# EAGLE design g3d2_ctrl_2 (EAGLE 6.2)
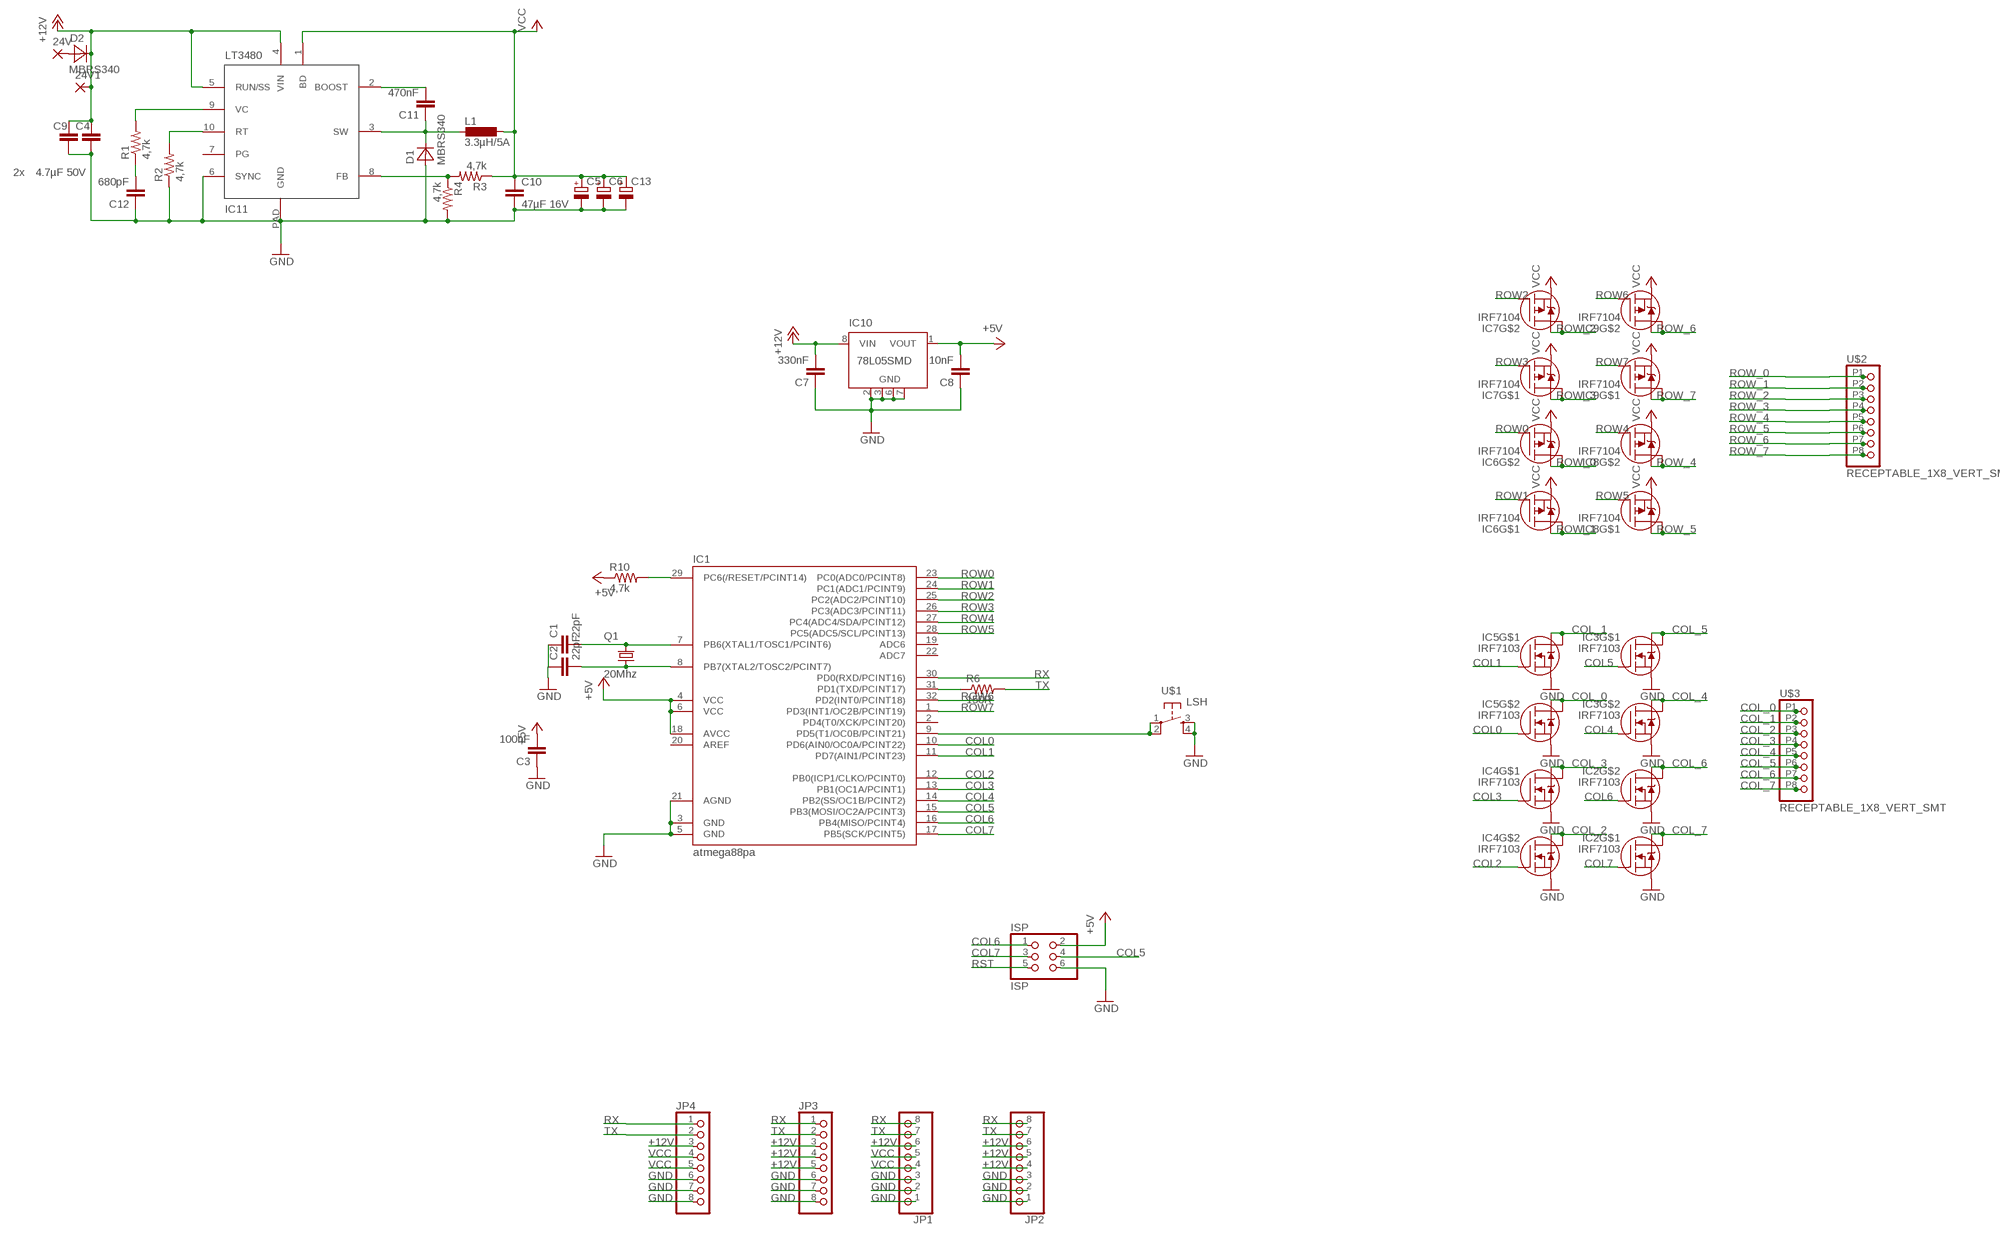
[diagram p0: schematic, sheet 1]

## Parts
24V  SMD5  [SMD2,54-5,08]
24V1  SMD5  [SMD2,54-5,08]
C1  22pF  CAP0805  [0805]
C2  22pF  CAP0805  [0805]
C3  100nF  CAP0805  [0805]
C4  4.7µF 50V  CAP1210  [1210]
C5  CPOL-EUSMCD  [SMC_D]
C6  CPOL-EUSMCD  [SMC_D]
C7  330nF  CAP0805  [0805]
C8  10nF  CAP0805  [0805]
C9  4.7µF 50V  CAP1210  [1210]
C10  47µF 16V  CAP1210  [1210]
C11  470nF  CAP0805  [0805]
C12  680pF  CAP0805  [0805]
C13  CPOL-EUSMCD  [SMC_D]
D1  MBRS340  [DO214AB]
D2  MBRS340  [DO214AB]
IC1  atmega88pa  MEGA48/88/168-AU  [TQFP32-08]
IC2  IRF7103  [SO8-2]
IC3  IRF7103  [SO8-2]
IC4  IRF7103  [SO8-2]
IC5  IRF7103  [SO8-2]
IC6  IRF7104  [SO8-2]
IC7  IRF7104  [SO8-2]
IC8  IRF7104  [SO8-2]
IC9  IRF7104  [SO8-2]
IC10  78L05SMD  [SO08]
IC11  LT3972  LT3480  [MSOP10-PAD]
ISP  ISP  PINHD-2X03_2.54  [2X03]
JP1  PINHD-1X08_2.54-SMD-90°  [1X08SMD/90]
JP2  PINHD-1X08_2.54-SMD-90°  [1X08SMD/90]
JP3  PINHD-1X08_2.54-SMD-90°  [1X08SMD/90]
JP4  PINHD-1X08_2.54-SMD-90°  [1X08SMD/90]
L1  3.3µH/5A  DO3316P  [DO3316P]
Q1  20Mhz  X22-OSCILLATOR  [X22]
R1  4,7k  RESISTOR  [0805]
R2  4,7k  RESISTOR  [0805]
R3  4,7k  RESISTOR  [0805]
R4  4,7k  RESISTOR  [0805]
R6  150R  RESISTOR  [0805]
R10  4,7k  RESISTOR  [0805]
U$1  LSH  [LSH]
U$2  RECEPTABLE_1X8_VERT_SMT  [RECEPTABLE_1X8_VERT_SMT]
U$3  RECEPTABLE_1X8_VERT_SMT  [RECEPTABLE_1X8_VERT_SMT]

## Nets
+5V: C3.2 C8.2 IC1.4(VCC) IC1.6(VCC) IC1.18(AVCC) IC10.1(VOUT) ISP.2 R10.1
+12V: 24V1.1(P) C4.1 C7.2 C9.1 D2.K(C) IC10.8(VIN) IC11.4(VIN) IC11.5(RUN/SS) JP1.6 JP2.4 JP2.5 JP2.6 JP3.3 JP3.4 JP3.5 JP4.3
COL0: IC1.10(PD6(AIN0/OC0A/PCINT22)) IC5.4(G)
COL1: IC1.11(PD7(AIN1/PCINT23)) IC5.2(G)
COL2: IC1.12(PB0(ICP1/CLKO/PCINT0)) IC4.4(G)
COL3: IC1.13(PB1(OC1A/PCINT1)) IC4.2(G)
COL4: IC1.14(PB2(SS/OC1B/PCINT2)) IC3.4(G)
COL5: IC1.15(PB3(MOSI/OC2A/PCINT3)) IC3.2(G) ISP.4
COL6: IC1.16(PB4(MISO/PCINT4)) IC2.4(G) ISP.1
COL7: IC1.17(PB5(SCK/PCINT5)) IC2.2(G) ISP.3
COL_0: IC5.5(D) IC5.6(D) U$3.P1
COL_1: IC5.7(D) IC5.8(D) U$3.P2
COL_2: IC4.5(D) IC4.6(D) U$3.P3
COL_3: IC4.7(D) IC4.8(D) U$3.P4
COL_4: IC3.5(D) IC3.6(D) U$3.P5
COL_5: IC3.7(D) IC3.8(D) U$3.P6
COL_6: IC2.5(D) IC2.6(D) U$3.P7
COL_7: IC2.7(D) IC2.8(D) U$3.P8
GND: C1.1 C2.1 C3.1 C4.2 C5.- C6.- C7.1 C8.1 C9.2 C10.2 C12.1 C13.- D1.A IC1.3(GND) IC1.5(GND) IC1.21(AGND) IC2.1(S) IC2.3(S) IC3.1(S) IC3.3(S) IC4.1(S) IC4.3(S) IC5.1(S) IC5.3(S) IC10.2(GND) IC10.3(GND) IC10.6(GND) IC10.7(GND) IC11.6(SYNC) IC11.PAD(GND) ISP.6 JP1.1 JP1.2 JP1.3 JP2.1 JP2.2 JP2.3 JP3.6 JP3.7 JP3.8 JP4.6 JP4.7 JP4.8 R2.1 R4.2 U$1.3 U$1.4
N$1: C2.2 IC1.8(PB7(XTAL2/TOSC2/PCINT7)) Q1.1
N$3: C1.2 IC1.7(PB6(XTAL1/TOSC1/PCINT6)) Q1.3
N$4: IC1.31(PD1(TXD/PCINT17)) R6.1
N$5: 24V.1(P) D2.A
N$6: IC11.10(RT) R2.2
N$7: IC1.9(PD5(T1/OC0B/PCINT21)) U$1.1 U$1.2
N$10: C12.2 R1.1
N$14: IC11.9(VC) R1.2
N$15: C11.1 D1.K(C) IC11.3(SW) L1.1
N$16: IC11.8(FB) R3.2 R4.1
N$17: C11.2 IC11.2(BOOST)
ROW0: IC1.23(PC0(ADC0/PCINT8)) IC6.4(G)
ROW1: IC1.24(PC1(ADC1/PCINT9)) IC6.2(G)
ROW2: IC1.25(PC2(ADC2/PCINT10)) IC7.4(G)
ROW3: IC1.26(PC3(ADC3/PCINT11)) IC7.2(G)
ROW4: IC1.27(PC4(ADC4/SDA/PCINT12)) IC8.4(G)
ROW5: IC1.28(PC5(ADC5/SCL/PCINT13)) IC8.2(G)
ROW6: IC1.32(PD2(INT0/PCINT18)) IC9.4(G)
ROW7: IC1.1(PD3(INT1/OC2B/PCINT19)) IC9.2(G)
ROW_0: IC6.5(D) IC6.6(D) U$2.P1
ROW_1: IC6.7(D) IC6.8(D) U$2.P2
ROW_2: IC7.5(D) IC7.6(D) U$2.P3
ROW_3: IC7.7(D) IC7.8(D) U$2.P4
ROW_4: IC8.5(D) IC8.6(D) U$2.P5
ROW_5: IC8.7(D) IC8.8(D) U$2.P6
ROW_6: IC9.5(D) IC9.6(D) U$2.P7
ROW_7: IC9.7(D) IC9.8(D) U$2.P8
RST: IC1.29(PC6(/RESET/PCINT14)) ISP.5 R10.2
RX: IC1.30(PD0(RXD/PCINT16)) JP1.8 JP2.8 JP3.1 JP4.1
TX: JP1.7 JP2.7 JP3.2 JP4.2 R6.2
VCC: C5.+ C6.+ C10.1 C13.+ IC6.1(S) IC6.3(S) IC7.1(S) IC7.3(S) IC8.1(S) IC8.3(S) IC9.1(S) IC9.3(S) IC11.1(BD) JP1.4 JP1.5 JP4.4 JP4.5 L1.2 R3.1
Unconnected: IC1.2(PD4(T0/XCK/PCINT20)) IC1.19(ADC6) IC1.20(AREF) IC1.22(ADC7) IC10.4(NC) IC10.5(NC) IC11.7(PG)

## Notes on the sheet
- 2x

## Library data of the parts
24V 24V1 = wirepad:SMD5: SMD PAD
C1-C4 C7-C12 = SparkFun:CAP: Capacitor Standard 0603 ceramic capacitor, and 0.1" leaded capacitor.
C5 C6 C13 = rcl:CPOL-EU: POLARIZED CAPACITOR, European symbol
D1 D2 = seb:MBRS340
IC1 = avr-4:MEGA48/88/168
IC2-IC5 = irf-2:IRF7103: HEXFET® Power MOSFET Adavanced Process Technology Ultra Low On-Resistance Dual N-Channel MOSFET Surface Mount Available in Tape & Reel Dynamic dv/dt Rating Fast Switching Please connect both Drain-Pins of each FET for thermal Reasons! (Pin 5 with Pin 6, 7 with 8)
IC6-IC9 = irf-2:IRF7104: HEXFET® Power MOSFET Adavanced Process Technology Ultra Low On-Resistance Dual P-Channel MOSFET Surface Mount Available in Tape & Reel Dynamic dv/dt Rating Fast Switching Please connect both Drain-Pins of each FET for thermal Reasons! (Pin 5 with Pin 6, 7 with 8)
IC10 = linear:78L*SMD: Positive VOLTAGE REGULATOR
IC11 = seb:LT3480
ISP = pinhead-2:PINHD-2X03: PIN HEADER
JP1-JP4 = pinhead-2:PINHD-1X08: PIN HEADER
L1 = inductor-coilcraft:DO3316P: COILCRAFT; OC_FARNELL: unknown; OC_NEWARK: unknown
Q1 = seb:X22-OSCILLATOR
R1-R4 R6 R10 = SparkFun:RESISTOR: Resistor Basic schematic elements and footprints for 0603, 1206, and PTH 1/10th watt (small) resistors.
U$1 = switch-tact:LSH
U$2 U$3 = seb:RECEPTABLE_1X8_VERT_SMT

## Board
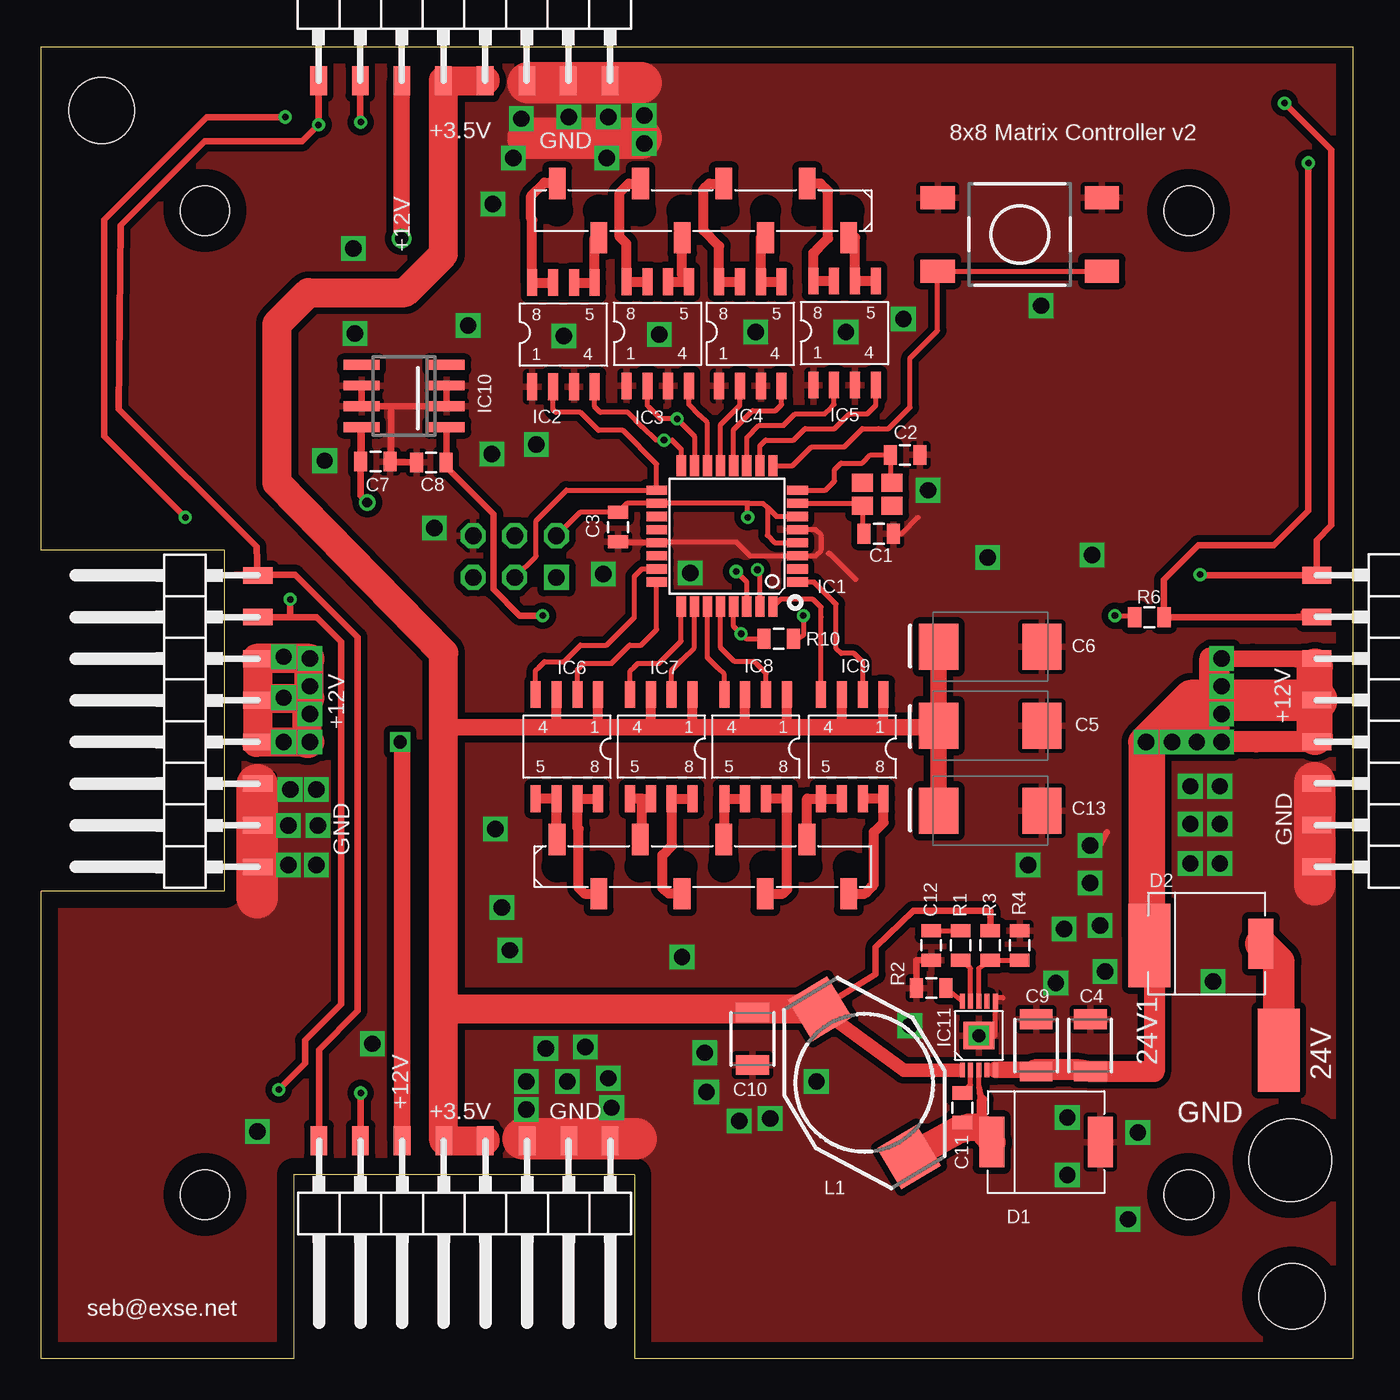
[diagram p1: board, top side]
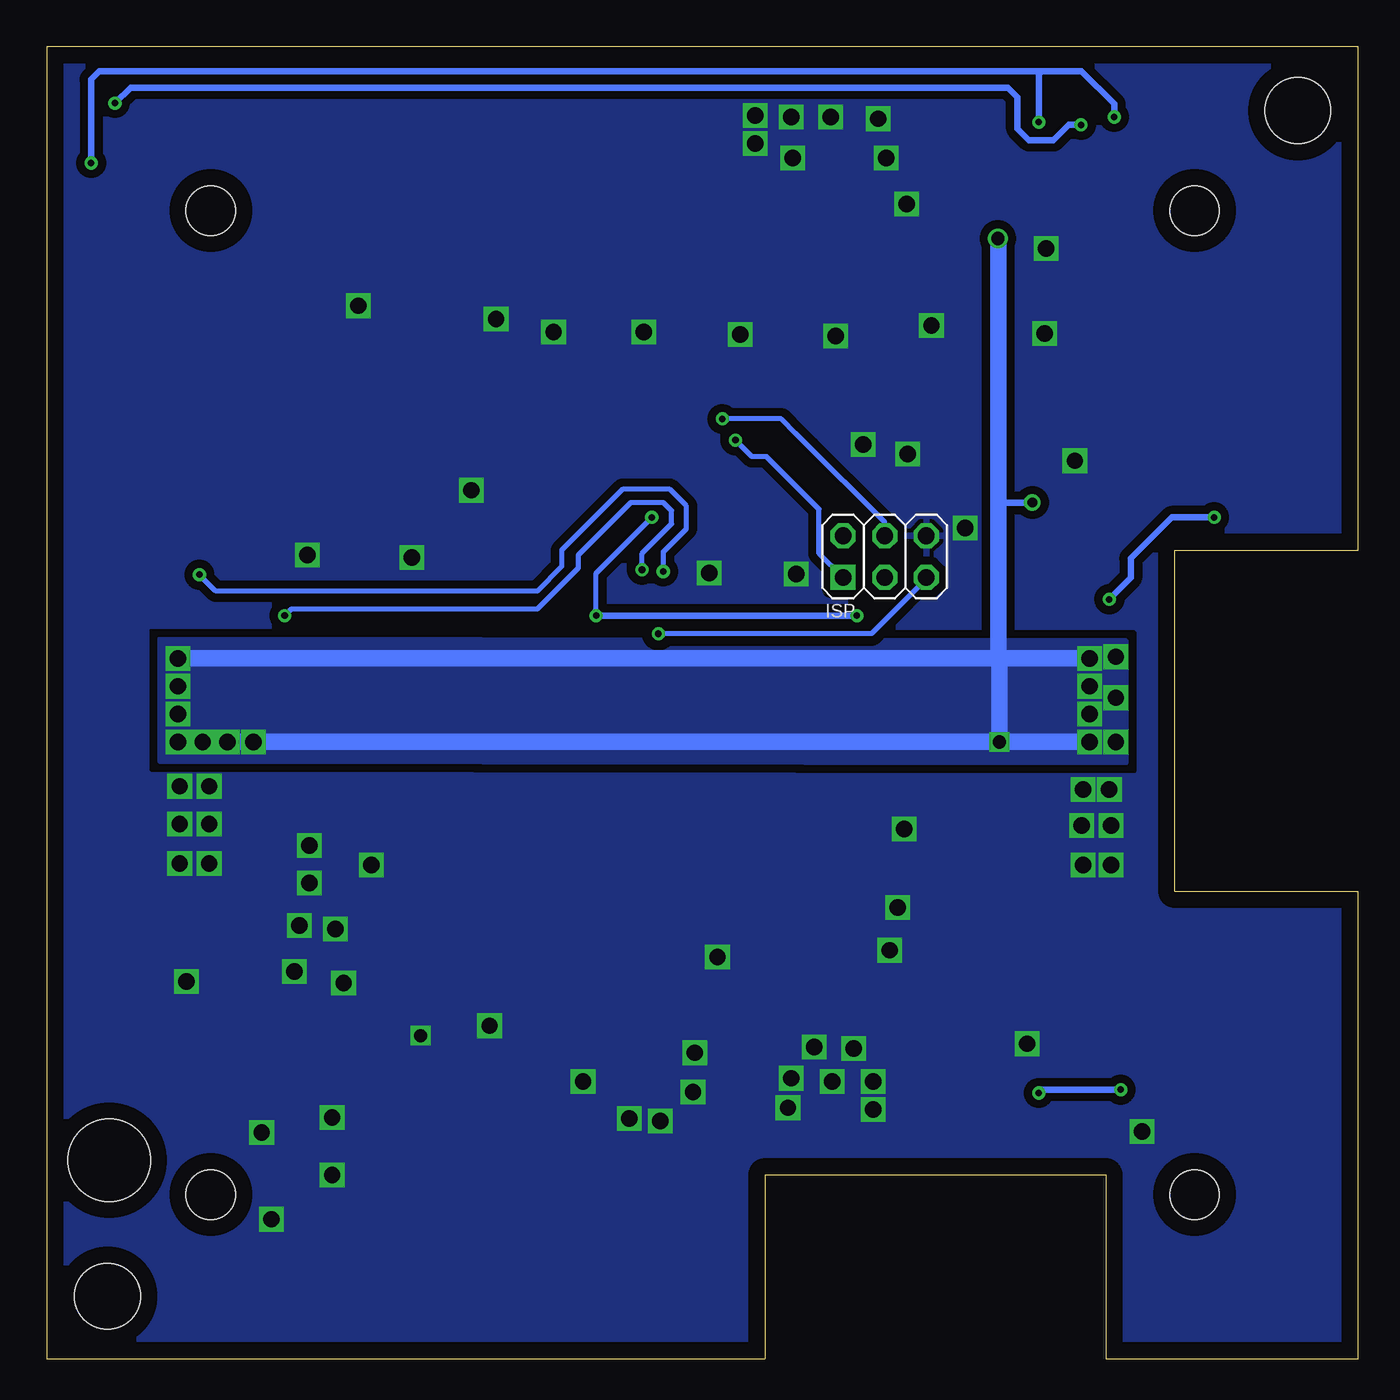
[diagram p2: board, bottom side, seen from below]

Size 80 x 80 mm. Coordinates in mm from the lower left corner, seen from the top.
Outline: 80,0 36.2,0 36.2,11.2 15.4,11.2 15.4,0 0,0 0,28.5 11.2,28.5 11.2,49.2 11.2,49.3 0,49.3 0,80 80,80 80,0
Copper layers (1*16): Top 0.035mm / dielectric 1.5mm / Bottom 0.035mm
Design rules: minimum track width 10mil, minimum drill 24mil, track to track 8mil, track to pad 8mil, pad to pad 8mil, via to via 8mil, smd to smd 8mil, copper to edge 40mil, drill to drill 8mil, minimum pad ring 10mil, minimum via ring 8mil, stop-mask expansion 4mil, vias tented up to drill 40mil, thermal gap 10mil
Holes 3 mm at 70,70 10,70 10,10 70,10
Holes 4 mm at 3.7,76.1 76.3,3.8
Holes 5 mm at 76.2,12.1

### Footprints (pad centres in the part's own frame; a part is rotated, then mirrored left to right if it is on the bottom)
SMD2,54-5,08 = smd 2.54 x 5.08: 1 0,0
0805 = smd 0.8 x 1.2: 1 -0.9,0; 2 0.9,0
1210 = smd 1.2 x 2: 1 -1.6,0; 2 1.6,0
SMC_D = smd 2.4 x 2.8: + -3.15,0; - 3.15,0
DO214AB = smd 1.52 x 3.07: A 3.305,0; K -3.305,0
TQFP32-08 = smd 1.27 x 0.559: 1 -4.293,2.8; 2 -4.293,2; 3 -4.293,1.2; 4 -4.293,0.4; 5 -4.293,-0.4; 6 -4.293,-1.2; 7 -4.293,-2; 8 -4.293,-2.8; 17 4.293,-2.8; 18 4.293,-2; 19 4.293,-1.2; 20 4.293,-0.4; 21 4.293,0.4; 22 4.293,1.2; 23 4.293,2; 24 4.293,2.8 | smd 0.559 x 1.27: 9 -2.8,-4.293; 10 -2,-4.293; 11 -1.2,-4.293; 12 -0.4,-4.293; 13 0.4,-4.293; 14 1.2,-4.293; 15 2,-4.293; 16 2.8,-4.293; 25 2.8,4.293; 26 2,4.293; 27 1.2,4.293; 28 0.4,4.293; 29 -0.4,4.293; 30 -1.2,4.293; 31 -2,4.293; 32 -2.8,4.293
SO8-2 = smd 0.61 x 1.626: 1 -2.54,-2.54; 2 -1.27,-2.54; 3 0,-2.54; 4 1.27,-2.54; 5 1.27,3.81; 6 0,3.81; 7 -1.27,3.81; 8 -2.54,3.81
SO08 = smd 0.6 x 2.2: 1 -1.905,-2.6; 2 -0.635,-2.6; 3 0.635,-2.6; 4 1.905,-2.6; 5 1.905,2.6; 6 0.635,2.6; 7 -0.635,2.6; 8 -1.905,2.6
MSOP10-PAD = smd 0.305 x 0.889: 1 -1,-2.095; 2 -0.5,-2.095; 3 0,-2.095; 4 0.5,-2.095; 5 1,-2.095; 6 1,2.095; 7 0.5,2.095; 8 0,2.095; 9 -0.5,2.095; 10 -1,2.095 | smd 1.88 x 1.68: PAD 0,0
2X03 = drill 1.016 square: 1 -2.54,-1.27 | drill 1.016 octagon: 2 -2.54,1.27; 3 0,-1.27; 4 0,1.27; 5 2.54,-1.27; 6 2.54,1.27
1X08SMD/90 = smd 1.016 x 1.778: 1 -1.27,-5.08; 2 1.27,-5.08; 3 3.81,-5.08; 4 6.35,-5.08; 5 8.89,-5.08; 6 11.43,-5.08; 7 13.97,-5.08; 8 16.51,-5.08
DO3316P = smd 2.92 x 2.79: 1 -5.28,0; 2 5.28,0
X22 = smd 1.3 x 1.1: 1 0.9,0.7; 2 -0.9,0.7; 3 -0.9,-0.7; 4 0.9,-0.7
LSH = smd 2.1 x 1.4: 1 -5.005,2.24; 2 5.015,2.24; 3 -5.005,-2.24; 4 5.005,-2.24
RECEPTABLE_1X8_VERT_SMT = smd 1.02 x 1.9: P1 -7.62,1.65; P2 -5.08,-1.65; P3 -2.54,1.65; P4 0,-1.65; P5 2.54,1.65; P6 5.08,-1.65; P7 7.62,1.65; P8 10.16,-1.65

### Placement (x,y rotation side)
24V  75.5,18.8 0 top
24V1  67.6,25.2 0 top
C1  51.1,50.3 180 top
C2  52.7,55.1 180 top
C3  35.2,50.7 90 top
C4  64,19.1 90 top
C5  57.9,38.6 0 top
C6  57.9,43.4 0 top
C7  20.4,54.7 180 top
C8  23.8,54.65 0 top
C9  60.7,19.1 90 top
C10  43.4,19.5 270 top
C11  56.2,15.3 90 top
C12  54.3,25.2 90 top
C13  57.9,33.4 0 top
D1  61.3,13.2 0 top
D2  71.1,25.3 0 top
IC1  41.85,50.15 180 top
IC2  32.5,61.8 0 top
IC3  38.25,61.85 0 top
IC4  43.9,61.85 0 top
IC5  49.65,61.9 0 top
IC6  31.45,37.95 180 top
IC7  37.2,37.95 180 top
IC8  42.95,37.95 180 top
IC9  48.85,37.95 180 top
IC10  22.15,58.7 90 top
IC11  57.2,19.7 0 top
ISP  28.9,48.9 0 bottom
JP1  33.46,8.21 180 top
JP2  8.15,31.25 90 top
JP3  82.9,46.5 270 top
JP4  18.2,83 0 top
L1  50.22,16.81 121 top
Q1  51,52.7 0 top
R1  56.1,25.2 270 top
R2  54.3,22.6 0 top
R3  57.9,25.2 270 top
R4  59.7,25.2 90 top
R6  67.6,45.2 0 top
R10  45,43.9 180 top
U$1  59.7,68.55 180 top
U$2  39.1,30 0 top
U$3  41.65,70 180 top

### Tracks (layer width: path | path; a pad name or v marks a point on that pad's centre or on a via)
+5V  (via drill 0.4)
  Top 0.305: 43.2,52.15 IC1.18 35.75,52.15 C3.2 32.87,51.6 ISP.2 | 43.2,52.15 44.05,52.15 44.3,51.9 | 44.3,51.9 44.85,51.35 IC1.6 | IC1.4 44.75,49.75 44.3,50.2 44.3,51.9 | R10.1 46.2,43.9 46.5,44.1 v46.5,45.3 | v43.1,51.3 43.1,52.05 43.2,52.15
  Top 0.406: 24.75,54.65 C8.2 | 24.75,54.65 IC10.1 | v30.6,45.3 29.2,45.3 27.6,46.9 27.6,51.5 24.75,54.35 24.75,54.65
  Bottom 0.305: v46.5,45.3 46.5,47.9 v43.1,51.3
  Bottom 0.406: v30.6,45.3 v46.5,45.3
+12V  (via drill 0.6, 0.8, 1)
  Top 0.305: IC11.5 IC11.4 | 24V1.1 67.8,25.2 D2.K
  Top 0.406: 19.55,54.5 IC10.8 19.5,56.8 C7.2 19.5,52.6 v19.9,52.2 | 73.9,42.69 77.7,42.2 | v72.01,42.69 v72,42.69 v72,42.7
  Top 1.016: v16.4,42.7 15.41,42.71 | v72.01,42.69 73.9,42.69 JP3.3 | 72.1,40.15 71.95,40.15 | v16.4,37.6 15.57,37.63 | JP3.5 72.41,37.61 v72,37.6 v72,39.3 v72,42.7 | JP4.3 22,74.21 v22,68.3 | IC11.5 60.6,17.61 C9.1 | JP1.6 22.03,37.6 v21.9,37.6 | 69.8,37.6 70.2,38.5
  Top 1.27: 60.6,17.61 63.3,17.61 C4.1 67.9,17.5 67.9,37.6 69.8,37.6 71.3,37.6 | 71.3,37.6 74.12,37.6 JP3.5 | v72,39.3 72.1,39.3 72.1,40.15 | 71.3,37.6 71.3,42.72 | 70.2,38.5 70.6,40.5 | 69.8,40.2 69.4,38.2
  Top 1.778: JP2.4 JP2.5 13.23,40.28 | JP2.6 13.23,40.28 | 16.4,42.68 JP2.6 | 16.3,42.7 16.4,42.68 | 16.3,42.7 13.13,42.7 JP2.6 | 16.3,42.7 v16.4,42.7 16.4,42.68 | 16.23,40.04 16.23,37.5 16.3,37.5 16.3,37.58 | 16.33,40.1 16.33,42.64 16.4,42.64 16.4,42.68 | 16.3,37.58 13.13,37.58 | v16.4,37.6 16.3,37.58 | 13.23,40.28 16.4,40.28 | D2.K 67.2,25.89 67.2,37.6 69.8,40.2 70.1,40.5 70.6,40.5
  Top 2.184: 77.7,37.9 77.7,42.2
  Top 2.54: 72.1,40.15 JP3.4
  Bottom 0.406: 21.95,52.1 21.85,52.2 v19.9,52.2
  Bottom 1.016: 21.9,42.7 v16.4,42.7 | v21.9,37.6 v16.4,37.6 | v21.9,37.6 v72,37.6 | v22,68.3 21.95,68.35 21.95,52.1 21.95,42.7 | 21.95,42.7 v72,42.7 | v21.9,37.6 21.9,42.7 | 21.9,42.7 21.95,42.7
  other vias: 72,41 16.4,41 16.4,39.3 14.8,37.6 14.8,40.3 14.8,42.8 70.5,37.6 67.4,37.6 69,37.6
  pour Bottom (isolate 0.6): 14.2,36.3 73.1,36.4 73.1,43.9 14.2,43.8
COL0
  Top 0.305: IC1.10 43.85,55.65 44.2,56 45.9,56 46.6,56.7 48.4,56.7 49.3,57.6 50.4,57.6 50.8,58 50.92,58.12 IC5.4
COL1
  Top 0.305: IC1.11 43.05,56.15 43.8,56.9 45.3,56.9 46,57.6 47.8,57.6 48.2,58 48.38,58.18 IC5.2
COL2
  Top 0.305: IC1.12 42.25,56.65 43.4,57.8 44.8,57.8 45.1,58.1 45.17,58.17 IC4.4
COL3
  Top 0.305: IC1.13 41.45,56.95 42.63,58.13 IC4.2
COL4
  Top 0.305: IC1.14 40.65,57.05 40.2,57.5 39.52,58.18 IC3.4
COL5  (via drill 0.4)
  Top 0.305: IC3.2 36.98,58.12 37.1,58 37.4,57.7 37.8,57.3 v38.8,57.3 39.85,56.25 IC1.15
  Bottom 0.305: v38.8,57.3 35.2,57.3 34.3,56.4 33.9,56 | 33.9,56 33.5,55.6 | ISP.4 28.9,51 33.9,56
COL6  (via drill 0.4)
  Top 0.305: IC2.4 33.77,58.03 33.9,57.9 34.1,57.7 35.8,57.7 36.7,56.8 37.5,56 v38,56 38.5,56 38.8,55.7 39.05,55.45 IC1.16
  Bottom 0.305: v38,56 37,55 36.7,55 36.1,55 32.9,51.8 32.9,49.09 ISP.1
COL7
  Top 0.305: IC2.2 31.23,57.87 31.3,57.8 31.4,57.7 32.9,57.7 34,56.6 35.5,56.6 37.56,54.54 IC1.17 32.05,52.95 30.2,51.1 30.2,48.93 ISP.3
COL_0
  Top 0.61: IC5.5 IC5.6 49.65,68.35 U$3.P1
COL_1
  Top 0.61: IC5.7 IC5.8 47.11,67.41 47.4,67.7 48,68.3 48,71.2 47.55,71.65 U$3.P2
COL_2
  Top 0.61: IC4.5 IC4.6 43.9,68.35 U$3.P3
COL_3
  Top 0.61: IC4.7 IC4.8 41.36,67.84 40.4,68.8 40.4,71.3 40.5,71.4 40.75,71.65 U$3.P4
COL_4
  Top 0.61: IC3.6 IC3.5 39.11,66.07 U$3.P5
COL_5
  Top 0.61: IC3.7 IC3.8 35.71,67.99 35.5,68.2 35.3,68.4 35.3,71.1 35.85,71.65 U$3.P6
COL_6
  Top 0.61: IC2.6 IC2.5 33.77,68.35 U$3.P7
COL_7
  Top 0.61: IC2.7 IC2.8 29.96,69.44 29.9,69.5 29.9,70.9 30.7,71.7 31.44,71.7 U$3.P8
GND  (via drill 0.8, 1)
  Top 0.3: 58.2,19.7 IC11.6 | 58.7,22 58.2,22
  Top 0.305: IC1.21 35.2,49.75 C3.1 42.4,49.8 43.25,48.95 IC1.3 47.25,48.95 47.6,49.3 47.6,50.2 47.25,50.55 IC1.5 | C1.1 52.5,50.3 53.5,51.3 | 48,49.1 48.1,49.1 49.7,47.5 | IC11.PAD 58.2,19.7 | 58.2,22 IC11.6
  Top 0.406: IC10.6 IC10.7 21.35,58.06 | IC10.3 IC10.2 21.35,58.06 | 21.35,58.06 21.35,54.7 C7.1 21.3,54.65 C8.1 | v64,31.3 64.4,31 65,32.1 | C12.1 53.4,24.3 R2.1
  Top 2.54: 77.7,28.9 77.7,35.1 | 13.2,28.1 13.2,35 | 29.4,13.4 36.3,13.4 | 29.7,74.4 36.6,74.4 | 36.6,77.8 29.7,77.8
  other vias: 66.3,8.5 64,29 61.9,22.9 71.5,23 57.2,19.7 64.9,23.6 13.2,13.85 54.1,52.95 61,64.2 28.8,73.2 34.5,73.2 57.75,48.85 43.6,62.6 60.2,30.1 34.3,47.85 31.9,62.35 42.6,14.5 20.2,19.2 62.6,14.7 49.1,62.6 36.8,75.8 36.8,74.1 53,20.3 39.6,47.9 33.2,19 19.15,62.5 70.1,30.2 70.1,32.6 70.1,34.9 15.2,34.7 15.1,30.1 15.1,32.5 29.6,16.9 28.6,24.9 40.49,18.65 47.3,16.9 37.7,62.45 34.6,75.7 30.2,55.75 64.1,49 62.6,11.2 66.9,13.8 32.1,16.9 30.8,18.9 17.3,54.75 24,50.65 27.5,55.15 27.55,70.4 26.05,63 40.59,16.25 44.49,14.65 71.9,34.9 71.9,32.6 71.9,30.2 16.8,30.1 16.9,32.5 16.8,34.7 34.6,17.1 34.8,15.3 29.6,15.2 29.3,75.6 32.2,75.7 62.4,26.2 64.6,26.4 52.6,63.4 28.1,27.5 27.7,32.3 39.1,24.5 19.05,67.7
  pour Top (isolate 0.4, rank 2): 0,80 80,80 80,0 0,0
  pour Bottom (isolate 0.5, rank 2): 0,80 80,80 80,0 0,0
N$1
  Top 0.305: Q1.1 51.8,53.5 C2.2 50.6,55.1 50.1,54.6 48.8,54.6 48.4,54.2 48.4,53.5 47.85,52.95 IC1.8
N$3
  Top 0.305: C1.2 50.1,50.4 Q1.3 49.95,52.15 IC1.7
N$4  (via drill 0.4)
  Top 0.305: IC1.31 43.85,47.95 v43.7,48.1 | v65.5,45.3 66.6,45.3 R6.1
  Bottom 0.305: v43.7,48.1 43.7,49.1 41.9,50.9 41.9,51.7 42.4,52.2 44.4,52.2 47.6,49 47.6,48.2 50.1,45.7 65.1,45.7 v65.5,45.3
N$5
  Top 1.93: 24V.1 75.5,24.2 D2.A
N$6
  Top 0.3: R2.2 IC11.10
  Top 0.305: IC11.10
N$7
  Top 0.305: IC1.9 45.84,54.44 47,55.6 49,55.6 50.1,56.7 51.1,56.7 51.7,56.7 53,58 53,61 54.6,62.6 54.69,62.69 U$1.2 U$1.1
N$10
  Top 0.305: C12.2 R1.1
N$14
  Top 0.3: IC11.9 56.7,23.8 R1.2
N$15
  Top 0.3: 57.4,14.6 57.2,16.6 | 57.2,16.6 IC11.3 | 57.2,16.6 57.4,15.8
  Top 0.305: 57.4,14.6 C11.1
  Top 0.61: 57.4,14.6 57.4,15.8 | 56.6,14.1 57.4,14.6 | 57.4,14.6 57.4,14
  Top 1.676: L1.1 55.85,13.9 56.6,14.1 57.3,14.1 57.9,13.39 D1.K
N$16
  Top 0.3: IC11.8 57.2,23.8 R3.2
  Top 0.305: R3.2 R4.1
N$17
  Top 0.3: IC11.2 56.7,16.7 C11.2
ROW0
  Top 0.305: IC1.23 36.65,48.15 36.2,47.7 36.2,45.2 34.5,43.5 32.9,43.5 31.9,42.5 30.7,42.5 30.4,42.2 30.18,41.98 IC6.4
ROW1
  Top 0.305: IC1.24 37.56,44.46 36.6,43.5 35.9,43.5 34.8,42.4 33.1,42.4 32.9,42.2 32.72,42.02 IC6.2
ROW2
  Top 0.305: IC1.25 39.05,43.75 37.7,42.4 36.4,42.4 36.2,42.2 35.93,41.93 IC7.4
ROW3
  Top 0.305: IC1.26 39.85,43.35 39.1,42.6 38.47,41.97 IC7.2
ROW4
  Top 0.305: IC1.27 40.65,42.75 41.3,42.1 41.68,41.72 IC8.4
ROW5
  Top 0.305: IC1.28 41.45,43.35 42.3,42.5 43.5,42.5 43.7,42.3 44.22,41.78 IC8.2
ROW6
  Top 0.305: IC9.4 47.58,45.22 47.58,45.82 47.1,46.3 45.09,46.3 IC1.32
ROW7
  Top 0.305: IC1.1 47.15,47.35 48.5,46 48.5,43.3 48.8,43 49.6,43 49.9,42.7 50.12,42.48 IC9.2
ROW_0
  Top 0.61: IC6.5 IC6.6 31.45,31.65 U$2.P1
ROW_1
  Top 0.61: IC6.8 IC6.7 32.72,32.38 32.8,32.3 32.8,28.7 33.15,28.35 33.99,28.35 U$2.P2
ROW_2
  Top 0.61: 36.65,34.14 IC7.5 | 36.65,34.14 IC7.6 | U$2.P3 36.65,31.65 36.65,34.14
ROW_3
  Top 0.61: 38.5,34.14 IC7.7 | 38.5,34.14 IC7.8 | U$2.P4 38.3,28.35 38,28.6 37.9,28.7 37.9,30.7 38.5,31.3 38.5,34.14
ROW_4
  Top 0.61: IC8.6 IC8.5 41.68,31.65 U$2.P5
ROW_5
  Top 0.61: IC8.7 IC8.8 45.49,28.61 45.5,28.6 45.25,28.35 44.22,28.35 U$2.P6
ROW_6
  Top 0.61: IC9.6 IC9.5 46.72,34.14 U$2.P7
ROW_7
  Top 0.61: IC9.7 IC9.8 51.39,32.69 50.8,32.1 50.8,30.3 50.8,28.9 50.6,28.7 50.25,28.35 U$2.P8
RST  (via drill 0.4)
  Top 0.305: R10.2 43,43.9 v42.7,44.2 42.25,44.65 IC1.29
  Bottom 0.305: v42.7,44.2 29.7,44.2 29.5,44.4 27.6,46.3 26.36,47.54 ISP.5
RX  (via drill 0.4)
  Top 0.305: IC1.30 43.05,47.35 v42.4,48
  Top 0.406: JP1.8 16.95,18.85 19.3,21.2 19.3,44 15.5,47.8 11.87,47.8 JP2.8 13.23,47.69 13.14,49.51 4.75,57.9 4.85,69.1 9.97,74.22 15.92,74.22 v16.93,75.23 JP4.1 | v75.85,76.55 78.7,73.7 78.7,50.8 77.82,49.9 JP3.1 | 77.02,47.8 JP3.1 | v70.7,47.8 70.73,47.77 JP3.1
  Bottom 0.305: v42.4,48 42.4,49.2 41,50.6 41,52 42,53 44.9,53 48.6,49.3 48.6,48.3 50.1,46.8 69.7,46.8 v70.7,47.8
  Bottom 0.406: v16.93,75.23 17.67,75.23 18.6,74.3 20.1,74.3 20.8,75 20.8,76.9 21.4,77.5 74.9,77.5 v75.85,76.55
TX  (via drill 0.4)
  Top 0.406: 76.63,45.23 JP3.2 | JP2.7 15.01,45.2 15.3,45.2 | 15.3,45.2 16.8,45.2 18.3,43.7 18.3,21.6 16.1,19.4 16.1,18 v14.5,16.4 | v19.5,75.39 19.47,75.52 JP4.2 | v14.9,75.7 10.1,75.7 3.85,69.45 3.85,56.35 3.85,56.25 v8.8,51.3 | 77.02,45.5 JP3.2 | v77.3,72.9 77.3,51.7 75.2,49.6 70.6,49.6 68.5,47.5 R6.2 77.02,45.2 JP3.2 | v19.5,16.2 JP1.7 | v15.2,46.3 15.2,45.3 15.3,45.2
  Bottom 0.406: v14.9,75.7 14.9,76.5 16.9,78.5 19.3,78.5 | 19.3,78.5 76.8,78.5 77.3,78 v77.3,72.9 | v19.5,75.39 19.5,78.3 19.3,78.5 | v14.5,16.4 19.3,16.4 v19.5,16.2 | v8.8,51.3 11.4,51.3 13.9,48.8 13.9,47.6 v15.2,46.3
VCC
  Top 0.305: IC11.1 55.9,17.61 55.9,17.6
  Top 0.406: R3.1 57.9,27.3 53.2,27.3 50.9,25.1 50.9,23.44 L1.2
  Top 0.61: 51.39,38.5 IC9.1 | 48.85,38.5 IC9.3 | 45.49,38.5 IC8.1 | 42.95,38.5 IC8.3 | 39.74,38.5 IC7.1 | 37.2,38.5 IC7.3 | 33.99,38.5 IC6.1 | 31.45,38.5 IC6.3
  Top 0.813: 55.9,17.6 52.64,17.6 L1.2 47.24,21.1 C10.1
  Top 1.016: 24.57,38.5 31.45,38.5 33.99,38.5 37.2,38.5 39.74,38.5 42.95,38.5 45.49,38.5 48.85,38.5 51.39,38.5 54.65,38.5 C5.+ | C5.+ C13.+ | C5.+ C6.+
  Top 1.778: JP1.4 JP1.5 24.57,21.34 | 24.57,21.34 24.57,38.5 24.57,43.03 14.4,53.4 14.4,63.1 16.3,65 22.2,65 24.55,67.35 JP4.4 JP4.5 | 24.57,21.34 L1.2

### Text on the board
tPlace: GND | 8x8 Matrix Controller v2 | +3.5V | +12V | +12V | +12V | GND | GND | +12V | +3.5V | GND | GND | seb@exse.net
tValues: 20Mhz X22